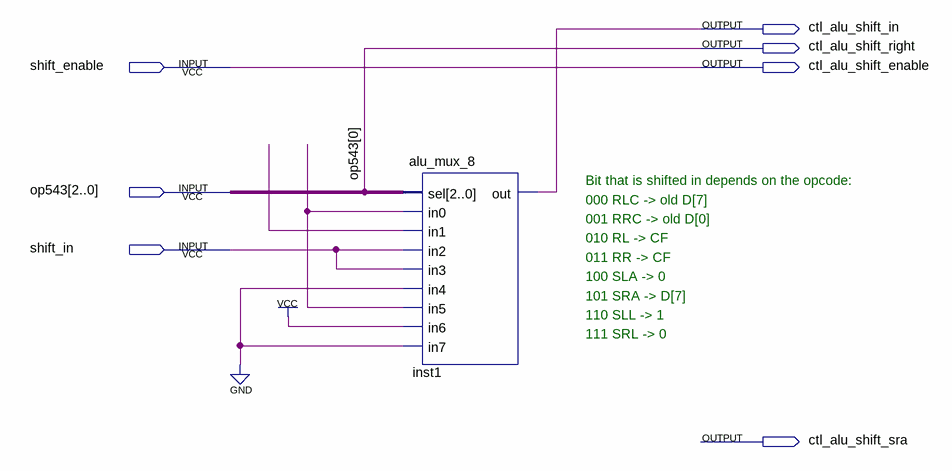
[diagram p0: schematic sheet]
// Quartus schematic alu_shifter.bdf as structural Verilog: 1 symbols, 7 pins
module alu_shifter (
  input  shift_enable,
  input  [2:0] op543,
  input  shift_in,
  output ctl_alu_shift_in,
  output ctl_alu_shift_right,
  output ctl_alu_shift_enable,
  output ctl_alu_shift_sra
);

  wire undriven, undriven_2;

  alu_mux_8 inst1 (
    .sel(op543), .in0(undriven_2), .in1(undriven), .in2(shift_in), .in3(shift_in), .in4(1'b0),
    .in5(undriven_2), .in6(1'b1), .in7(1'b0), .out(ctl_alu_shift_in));

  assign ctl_alu_shift_enable = shift_enable;
  assign ctl_alu_shift_right = op543[0];

  // Notes on the sheet:
  //   Bit that is shifted in depends on the opcode:
  //   000 RLC -> old D[7]
  //   001 RRC -> old D[0]
  //   010 RL -> CF
  //   011 RR -> CF
  //   100 SLA -> 0
  //   101 SRA -> D[7]
  //   110 SLL -> 1
  //   111 SRL -> 0
endmodule
